# Altium schematic sheet MainMCU.SchDoc
size B; SheetNumber: 3; SheetTotal: 6
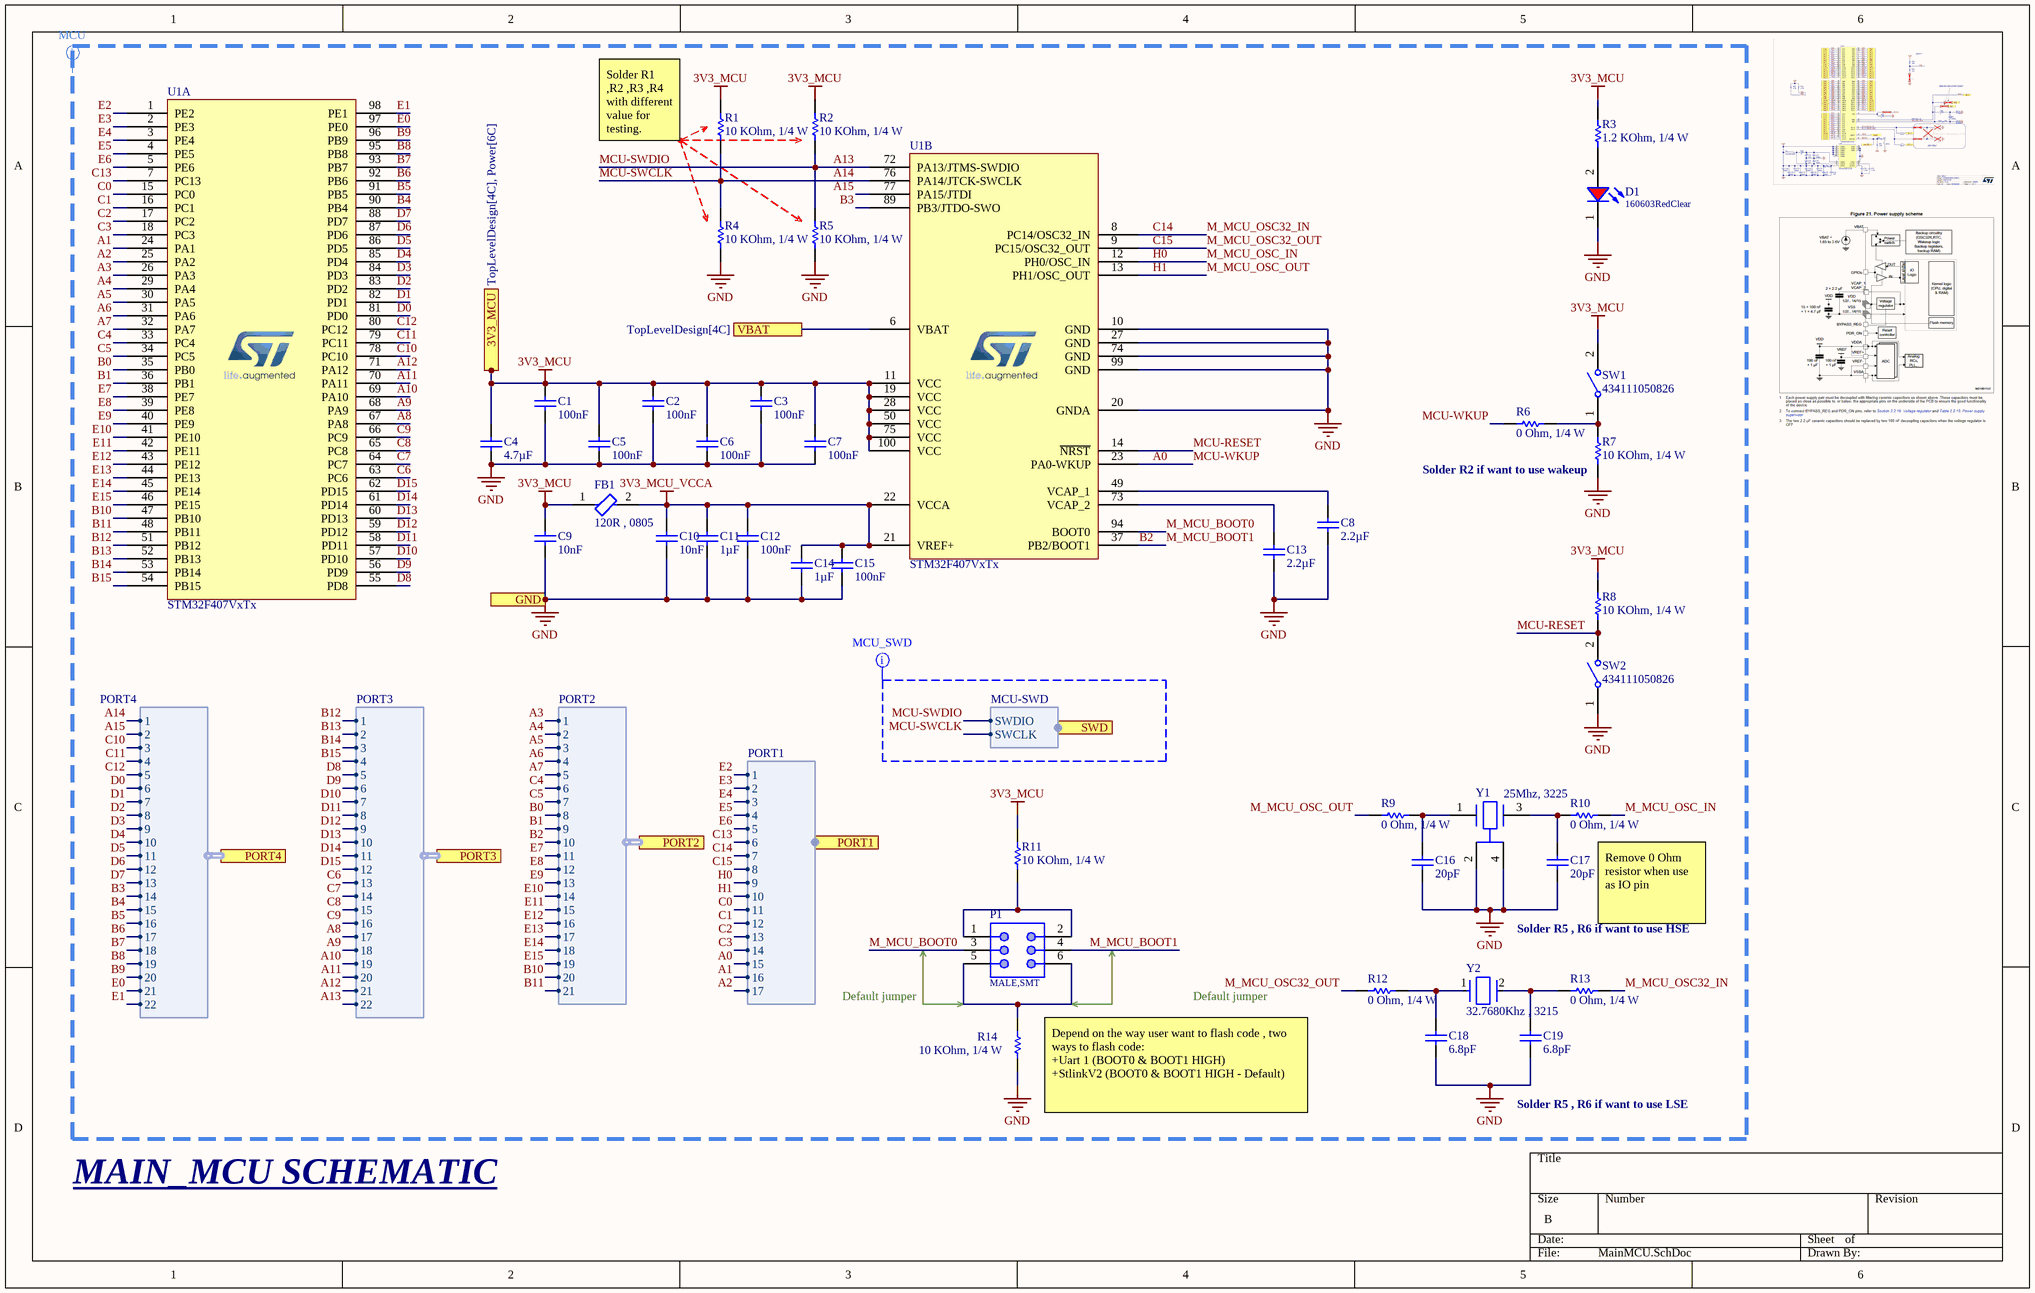
[diagram p0: MainMCU.SchDoc]

## Parts
C1  value 100nF  [CAP_0603]  (hidden comment: 0106031010550)
C2  value 100nF  [CAP_0603]  (hidden comment: 0106031010550)
C3  value 100nF  [CAP_0603]  (hidden comment: 0106031010550)
C4  value 4.7µF  [CAP_0603]  (hidden comment: 0106034751010)
C5  value 100nF  [CAP_0603]  (hidden comment: 0106031010550)
C6  value 100nF  [CAP_0603]  (hidden comment: 0106031010550)
C7  value 100nF  [CAP_0603]  (hidden comment: 0106031010550)
C8  value 2.2µF  [CAP_0603]  (hidden comment: 0106032251010)
C9  value 10nF  [CAP_0603]  (hidden comment: 0106031030550)
C10  value 10nF  [CAP_0603]  (hidden comment: 0106031030550)
C11  value 1µF  [CAP_0603]  (hidden comment: 0106031051035)
C12  value 100nF  [CAP_0603]  (hidden comment: 0106031010550)
C13  value 2.2µF  [CAP_0603]  (hidden comment: 0106032251010)
C14  value 1µF  [CAP_0603]  (hidden comment: 0106031051035)
C15  value 100nF  [CAP_0603]  (hidden comment: 0106031010550)
C16  value 20pF  [CAP_0603]  (hidden comment: 0106031000550)
C17  value 20pF  [CAP_0603]  (hidden comment: 0106031000550)
C18  value 6.8pF  [CAP_0603]  (hidden comment: 0106031000550)
C19  value 6.8pF  [CAP_0603]  (hidden comment: 0106031000550)
D1  160603RedClear  [WL-SMCW_0603_H=0.7mm]
FB1  120R , 0805  [FP-BLM18-0_15-t0_8-MFG]
P1  MALE,SMT  [61030621121]
R1  value 10 KOhm, 1/4 W  [resistor_0603]  (hidden comment: 0006031031)
R2  value 10 KOhm, 1/4 W  [resistor_0603]  (hidden comment: 0006031031)
R3  value 1.2 KOhm, 1/4 W  [resistor_0603]  (hidden comment: 0006031221)
R4  value 10 KOhm, 1/4 W  [resistor_0603]  (hidden comment: 0006031031)
R5  value 10 KOhm, 1/4 W  [resistor_0603]  (hidden comment: 0006031031)
R6  value 0 Ohm, 1/4 W  [resistor_0603]  (hidden comment: 0006030001)
R7  value 10 KOhm, 1/4 W  [resistor_0603]  (hidden comment: 0006031031)
R8  value 10 KOhm, 1/4 W  [resistor_0603]  (hidden comment: 0006031031)
R9  value 0 Ohm, 1/4 W  [resistor_0603]  (hidden comment: 0006030001)
R10  value 0 Ohm, 1/4 W  [resistor_0603]  (hidden comment: 0006030001)
R11  value 10 KOhm, 1/4 W  [resistor_0603]  (hidden comment: 0006031031)
R12  value 0 Ohm, 1/4 W  [resistor_0603]  (hidden comment: 0006030001)
R13  value 0 Ohm, 1/4 W  [resistor_0603]  (hidden comment: 0006030001)
R14  value 10 KOhm, 1/4 W  [resistor_0603]  (hidden comment: 0006031031)
SW1  434111050826  [WS-TASV_L6W3.5H5_4341x10508x6]
SW2  434111050826  [WS-TASV_L6W3.5H5_4341x10508x6]
U1  STM32F407VxTx  [STM32F407VGTx]  (parts A,B of 2)
Y1  25Mhz, 3225  [FP-NX3225SA-MFG]
Y2  32.7680Khz , 3215  [FP-FC-135-MFG]

## Ports
3V3_MCU (see TopLevelDesign[4C], Power[6C]), GND (see TopLevelDesign[4C], Header_and_OnboardConponents[5D], Power[5C], ST-LinkV2[3B]), PORT1 (harness PORT1, see TopLevelDesign[4C]), PORT2 (harness PORT2, see TopLevelDesign[4C]), PORT3 (harness PORT3, see TopLevelDesign[4C]), PORT4 (harness PORT4, see TopLevelDesign[4C]), SWD (harness MCU-SWD, see TopLevelDesign[4C], ST-LinkV2[3C]), VBAT (see TopLevelDesign[4C])

## Harnesses
PORT2: 1, 2, 3, 4, 5, 6, 7, 8, 9, 10, 11, 12, 13, 14, 15, 16, 17, 18, 19, 20, 21
PORT3: 1, 2, 3, 4, 5, 6, 7, 8, 9, 10, 11, 12, 13, 14, 15, 16, 17, 18, 19, 20, 21, 22
PORT1: 1, 2, 3, 4, 5, 6, 7, 8, 9, 10, 11, 12, 13, 14, 15, 16, 17
PORT4: 1, 2, 3, 4, 5, 6, 7, 8, 9, 10, 11, 12, 13, 14, 15, 16, 17, 18, 19, 20, 21, 22
MCU-SWD: SWDIO, SWCLK

## Nets
3V3_MCU: C1.2 C2.2 C3.2 C4.2 C5.2 C6.2 C7.2 C9.2 FB1.1 R1.2 R2.2 R3.2 R8.2 R11.2 SW1.2 U1.11(VCC) U1.19(VCC) U1.28(VCC) U1.50(VCC) U1.75(VCC) U1.100(VCC) ; port 3V3_MCU
3V3_MCU_VCCA: C10.2 C11.2 C12.2 C14.2 C15.2 FB1.2 U1.21(VREF+) U1.22(VCCA)
GND: C1.1 C2.1 C3.1 C4.1 C5.1 C6.1 C7.1 C8.1 C9.1 C10.1 C11.1 C12.1 C13.1 C14.1 C15.1 C16.1 C17.1 C18.1 C19.1 D1.1(K) R4.1 R5.1 R7.1 R14.1 SW2.1 U1.10(GND) U1.20(GNDA) U1.27(GND) U1.74(GND) U1.99(GND) Y1.2(GND) Y1.4(GND) ; port GND
A0: R6.1 U1.23(PA0-WKUP) ; port PORT1.15  [also labelled MCU-WKUP]
A1: U1.24(PA1) ; port PORT1.16
A2: U1.25(PA2) ; port PORT1.17
A3: U1.26(PA3) ; port PORT2.1
A4: U1.29(PA4) ; port PORT2.2
A5: U1.30(PA5) ; port PORT2.3
A6: U1.31(PA6) ; port PORT2.4
A7: U1.32(PA7) ; port PORT2.5
A8: U1.67(PA8) ; port PORT3.17
A9: U1.68(PA9) ; port PORT3.18
A10: U1.69(PA10) ; port PORT3.19
A11: U1.70(PA11) ; port PORT3.20
A12: U1.71(PA12) ; port PORT3.21
A13: R2.1 R5.2 U1.72(PA13/JTMS-SWDIO) ; port PORT3.22, port SWD.SWDIO  [also labelled MCU-SWDIO]
A14: R1.1 R4.2 U1.76(PA14/JTCK-SWCLK) ; port PORT4.1, port SWD.SWCLK  [also labelled MCU-SWCLK]
A15: U1.77(PA15/JTDI) ; port PORT4.2
B0: U1.35(PB0) ; port PORT2.8
B1: U1.36(PB1) ; port PORT2.9
B2: P1.4 U1.37(PB2/BOOT1) ; port PORT2.10  [also labelled M_MCU_BOOT1]
B3: U1.89(PB3/JTDO-SWO) ; port PORT4.14
B4: U1.90(PB4) ; port PORT4.15
B5: U1.91(PB5) ; port PORT4.16
B6: U1.92(PB6) ; port PORT4.17
B7: U1.93(PB7) ; port PORT4.18
B8: U1.95(PB8) ; port PORT4.19
B9: U1.96(PB9) ; port PORT4.20
B10: U1.47(PB10) ; port PORT2.20
B11: U1.48(PB11) ; port PORT2.21
B12: U1.51(PB12) ; port PORT3.1
B13: U1.52(PB13) ; port PORT3.2
B14: U1.53(PB14) ; port PORT3.3
B15: U1.54(PB15) ; port PORT3.4
C0: U1.15(PC0) ; port PORT1.11
C1: U1.16(PC1) ; port PORT1.12
C2: U1.17(PC2) ; port PORT1.13
C3: U1.18(PC3) ; port PORT1.14
C4: U1.33(PC4) ; port PORT2.6
C5: U1.34(PC5) ; port PORT2.7
C6: U1.63(PC6) ; port PORT3.13
C7: U1.64(PC7) ; port PORT3.14
C8: U1.65(PC8) ; port PORT3.15
C9: U1.66(PC9) ; port PORT3.16
C10: U1.78(PC10) ; port PORT4.3
C11: U1.79(PC11) ; port PORT4.4
C12: U1.80(PC12) ; port PORT4.5
C13: U1.7(PC13) ; port PORT1.6
C14: R13.2 U1.8(PC14/OSC32_IN) ; port PORT1.7  [also labelled M_MCU_OSC32_IN]
C15: R12.1 U1.9(PC15/OSC32_OUT) ; port PORT1.8  [also labelled M_MCU_OSC32_OUT]
D0: U1.81(PD0) ; port PORT4.6
D1: U1.82(PD1) ; port PORT4.7
D2: U1.83(PD2) ; port PORT4.8
D3: U1.84(PD3) ; port PORT4.9
D4: U1.85(PD4) ; port PORT4.10
D5: U1.86(PD5) ; port PORT4.11
D6: U1.87(PD6) ; port PORT4.12
D7: U1.88(PD7) ; port PORT4.13
D8: U1.55(PD8) ; port PORT3.5
D9: U1.56(PD9) ; port PORT3.6
D10: U1.57(PD10) ; port PORT3.7
D11: U1.58(PD11) ; port PORT3.8
D12: U1.59(PD12) ; port PORT3.9
D13: U1.60(PD13) ; port PORT3.10
D14: U1.61(PD14) ; port PORT3.11
D15: U1.62(PD15) ; port PORT3.12
E0: U1.97(PE0) ; port PORT4.21
E1: U1.98(PE1) ; port PORT4.22
E2: U1.1(PE2) ; port PORT1.1
E3: U1.2(PE3) ; port PORT1.2
E4: U1.3(PE4) ; port PORT1.3
E5: U1.4(PE5) ; port PORT1.4
E6: U1.5(PE6) ; port PORT1.5
E7: U1.38(PE7) ; port PORT2.11
E8: U1.39(PE8) ; port PORT2.12
E9: U1.40(PE9) ; port PORT2.13
E10: U1.41(PE10) ; port PORT2.14
E11: U1.42(PE11) ; port PORT2.15
E12: U1.43(PE12) ; port PORT2.16
E13: U1.44(PE13) ; port PORT2.17
E14: U1.45(PE14) ; port PORT2.18
E15: U1.46(PE15) ; port PORT2.19
H0: R10.2 U1.12(PH0/OSC_IN) ; port PORT1.9  [also labelled M_MCU_OSC_IN]
H1: R9.1 U1.13(PH1/OSC_OUT) ; port PORT1.10  [also labelled M_MCU_OSC_OUT]
M_MCU_BOOT0: P1.3 U1.94(BOOT0)
MCU-RESET: R8.1 SW2.2 U1.14(~{NRST})
VBAT: U1.6(VBAT) ; port VBAT
NetC8_2: C8.2 U1.49(VCAP_1)
NetC13_2: C13.2 U1.73(VCAP_2)
NetC16_2: C16.2 R9.2 Y1.1
NetC17_2: C17.2 R10.1 Y1.3
NetC18_2: C18.2 R12.2 Y2.1
NetC19_2: C19.2 R13.1 Y2.2
NetD1_2: D1.2(A) R3.1
NetP1_1: P1.1 P1.2 R11.1
NetP1_5: P1.5 P1.6 R14.2
NetR6_2: R6.2 R7.2 SW1.1

## Layout directives
net class MCU_SWD; rule Matched Net Lengths [Delay Tolerance = 70ps]: MCU-SWCLK, MCU-SWDIO
mark named MCU: 3V3_MCU, 3V3_MCU_VCCA, A0, A1, A2, A3, A4, A5, A6, A7, A8, A9, A10, A11, A12, A13, A14, A15, B0, B1, B2, B3, B4, B5, B6, B7, B8, B9, B10, B11, B12, B13, B14, B15, C0, C1, C2, C3, C4, C5, C6, C7, C8, C9, C10, C11, C12, C13, C14, C15, D0, D1, D2, D3, D4, D5, D6, D7, D8, D9, D10, D11, D12, D13, D14, D15, E0, E1, E2, E3, E4, E5, E6, E7, E8, E9, E10, E11, E12, E13, E14, E15, GND, H0, H1, M_MCU_BOOT0, M_MCU_BOOT1, M_MCU_OSC32_IN, M_MCU_OSC32_OUT, M_MCU_OSC_IN, M_MCU_OSC_OUT, MCU-RESET, MCU-SWCLK, MCU-SWDIO, MCU-WKUP

## Notes on the sheet
- (near R1) Solder R1 ,R2 ,R3 ,R4 with different value for testing.
- (near R7) Solder R2 if want to use wakeup
- Solder R5 , R6 if want to use HSE
- Remove 0 Ohm resistor when use as IO pin
- Default jumper
- (near R14) Depend on the way user want to flash code , two ways to flash code:
  +Uart 1 (BOOT0 & BOOT1 HIGH)
  +StlinkV2 (BOOT0 & BOOT1 HIGH - Default)
- Solder R5 , R6 if want to use LSE
- MAIN_MCU SCHEMATIC

## Library data of the parts
C1-C3 C5-C7 C12 C15 = CMP-001-00209-1: CAP, size 0603, 100 nF, 50 VDC; Manufacture Name: TDK; Manufacture SN: CGA3E2C0G1H101J080AA; Voltage Rating DC: 50 VDC; Tolerance: 5%; Packaging: Tape and Reel; Supplier 3 SN: N/A; Source: Capacitor_0603_5_percent.SchLib; Supplier 1 URL: https://www.mouser.com/ProductDetail/TDK/CGA3E2C0G1H101J080AA?qs=FxQuwy19cyBF0gUakpLdHA%3D%3D&utm_source=mouser-refine-download&utm_medium=file&utm_campaign=CGA3E2C0G1H101J080AA&utm_content=TDK; Supplier 3 URL: N/A; Supplier 2 URL: https://www.digikey.com/en/products/detail/tdk-corporation/cga3e2c0g1h101j080aa/2443118; Supplier 2 Name: Digi-Key; Supplier 1 SN: 810-CGA3E2C0G1H101J; Mounting Technology: SMT; Size: 0603; Design Item ID: 0106031010550; Supplier 1 Name: Mouser; Component Type: Standard; Operating Temperature: -55 to +125degC; Supplier 3 Name: thegioiic; Pins: 2; Supplier 2 SN: 445-5640-2-ND
C4 = CMP-001-00249-1: CAP, size 0603, 4.7 uF, 10 VDC; Manufacture SN: CL10A475KP8NNWC; Manufacture Name: Samsung Electro-Mechanics; Tolerance: 10%; Voltage Rating DC: 10 VDC; Mounting Technology: SMT; Supplier 3 URL: https://www.thegioiic.com/tu-gom-0603-4-7uf-25v; Source: Capacitor_0603_10_percent.SchLib; Packaging: Tape and Reel; Component Type: Standard; Supplier 2 SN: 1276-CL10A475KP8NNWCTR-ND; Pins: 2; Size: 0603; Supplier 1 URL: https://www.mouser.vn/ProductDetail/Samsung-Electro-Mechanics/CL10A475KP8NNWC?qs=81r%252BiQLm7BQyXBb52PEUBA%3D%3D&utm_source=mouser-refine-download&utm_medium=file&utm_campaign=CL10A475KP8NNWC&utm_content=Samsung-Electro-Mechanics; Supplier 2 URL: https://www.digikey.com/en/products/detail/samsung-electro-mechanics/cl10a475kp8nnwc/16572736; Design Item ID: 0106034751010; Supplier 3 Name: thegioiic; Supplier 2 Name: Digi-Key; Supplier 1 SN: 187-CL10A475KP8NNWC; Supplier 1 Name: Mouser; Supplier 3 SN: N/A; Operating Temperature: -55 to +125degC
C8 C13 = CMP-001-00232-1: CAP, size 0603, 2.2 uF, 10 VDC; Manufacture SN: CL10A225KP8NNWC; Manufacture Name: Samsung Electro-Mechanics; Voltage Rating DC: 10 VDC; Tolerance: 10%; Supplier 2 SN: 1276-CL10A225KP8NNWCTR-ND; Supplier 1 Name: Mouser; Supplier 2 Name: Digi-Key; Size: 0603; Supplier 3 URL: N/A; Supplier 2 URL: https://www.digikey.com/en/products/detail/samsung-electro-mechanics/cl10a225kp8nnwc/16572766; Supplier 3 Name: thegioiic; Design Item ID: 0106032251010; Supplier 3 SN: N/A; Operating Temperature: -55 to +125degC; Source: Capacitor_0603_10_percent.SchLib; Supplier 1 URL: https://www.mouser.vn/ProductDetail/Samsung-Electro-Mechanics/CL10A225KP8NNWC?qs=f6khj2Jg0Fj5oIVDjMV6rg%3D%3D&utm_source=mouser-refine-download&utm_medium=file&utm_campaign=CL10A225KP8NNWC&utm_content=Samsung-Electro-Mechanics; Supplier 1 SN: 187-CL10A225KP8NNWC; Component Type: Standard; Packaging: Tape and Reel; Mounting Technology: SMT; Pins: 2
C9 C10 = CMP-001-00212-1: CAP, size 0603, 10 nF, 50 VDC; Manufacture SN: CGA3E2C0G1H103J080AE; Manufacture Name: TDK; Tolerance: 5%; Voltage Rating DC: 50 VDC; Design Item ID: 0106031030550; Pins: 2; Operating Temperature: -55 to +125degC; Packaging: Tape and Reel; Supplier 1 SN: 810-CGA3E2C0G1H103J8; Source: Capacitor_0603_5_percent.SchLib; Supplier 3 URL: N/A; Component Type: Standard; Supplier 3 SN: N/A; Supplier 2 Name: Digi-Key; Mounting Technology: SMT; Supplier 3 Name: thegioiic; Supplier 1 URL: https://www.mouser.com/ProductDetail/TDK/CGA3E2C0G1H103J080AE?qs=P1JMDcb91o6ZkMITrWTUZQ%3D%3D&utm_source=mouser-refine-download&utm_medium=file&utm_campaign=CGA3E2C0G1H103J080AE&utm_content=TDK; Supplier 2 URL: https://www.digikey.com/en/products/detail/tdk-corporation/cga3e2c0g1h103j080ae/11697946; Supplier 2 SN: 445-CGA3E2C0G1H103J080AETR-ND; Supplier 1 Name: Mouser; Size: 0603
C11 C14 = CMP-001-00217-1: CAP, size 0603, 1 uF, 35 VDC; Manufacture Name: Samsung Electro-Mechanics; Manufacture SN: CL10B105KL9VPJC; Tolerance: 10%; Voltage Rating DC: 35 VDC; Supplier 1 SN: 187-CL10B105KL9VPJC; Supplier 1 URL: https://www.mouser.vn/ProductDetail/Samsung-Electro-Mechanics/CL10B105KL9VPJC?qs=Jm2GQyTW%2Fbg7HPXOYntRzg%3D%3D&utm_source=mouser-refine-download&utm_medium=file&utm_campaign=CL10B105KL9VPJC&utm_content=Samsung-Electro-Mechanics; Pins: 2; Supplier 2 URL: N/A; Mounting Technology: SMT; Operating Temperature: -55 to +125degC; Supplier 1 Name: Mouser; Component Type: Standard; Design Item ID: 0106031051035; Size: 0603; Supplier 3 SN: N/A; Source: Capacitor_0603_10_percent.SchLib; Supplier 3 Name: thegioiic; Supplier 2 SN: N/A; Supplier 3 URL: N/A; Packaging: Tape and Reel; Supplier 2 Name: Digi-Key
C16 C17 = CMP-001-00208-1: CAP, size 0603, 20 pF, 50 VDC; Manufacture SN: CGA3E2NP01H100D080AA; Manufacture Name: TDK; Tolerance: 5%; Voltage Rating DC: 50 VDC; Component Type: Standard; Size: 0603; Source: Capacitor_0603_5_percent.SchLib; Supplier 3 SN: N/A; Supplier 2 URL: https://www.digikey.com/en/products/detail/tdk-corporation/cga3e2np01h100d080aa/3949623; Supplier 1 Name: Mouser; Pins: 2; Supplier 1 SN: 810-CGA3E2NP01H100DA; Packaging: Tape and Reel; Supplier 2 Name: Digi-Key; Supplier 3 Name: thegioiic; Supplier 2 SN: 445-12387-2-ND; Operating Temperature: -55 to +125degC; Supplier 1 URL: https://www.mouser.com/ProductDetail/TDK/CGA3E2NP01H100D080AA?qs=xLDY6iXSiQYSDBjUp7bVxg%3D%3D&utm_source=mouser-refine-download&utm_medium=file&utm_campaign=CGA3E2NP01H100D080AA&utm_content=TDK; Design Item ID: 0106031000550; Supplier 3 URL: N/A; Mounting Technology: SMT
C18 C19 = CMP-001-00208-1: CAP, size 0603, 6.8 pF, 50 VDC; Manufacture SN: CGA3E2NP01H100D080AA; Manufacture Name: TDK; Tolerance: 5%; Voltage Rating DC: 50 VDC; Component Type: Standard; Size: 0603; Source: Capacitor_0603_5_percent.SchLib; Supplier 3 SN: N/A; Supplier 2 URL: https://www.digikey.com/en/products/detail/tdk-corporation/cga3e2np01h100d080aa/3949623; Supplier 1 Name: Mouser; Pins: 2; Supplier 1 SN: 810-CGA3E2NP01H100DA; Packaging: Tape and Reel; Supplier 2 Name: Digi-Key; Supplier 3 Name: thegioiic; Supplier 2 SN: 445-12387-2-ND; Operating Temperature: -55 to +125degC; Supplier 1 URL: https://www.mouser.com/ProductDetail/TDK/CGA3E2NP01H100D080AA?qs=xLDY6iXSiQYSDBjUp7bVxg%3D%3D&utm_source=mouser-refine-download&utm_medium=file&utm_campaign=CGA3E2NP01H100D080AA&utm_content=TDK; Design Item ID: 0106031000550; Supplier 3 URL: N/A; Mounting Technology: SMT
D1 = CMP-004-00094-1: WL-SMCW SMT Mono-color Chip LED Waterclear, size 0603, Red, 2V, 140deg; Type: Clear; Value: Red, 2V; ComponentLink4URL: https://www.thegioiic.com/led-do-0603-dan-smd-trong-suot; Supplier 3 URL: https://www.thegioiic.com/led-do-0603-dan-smd-trong-suot; ComponentLink3URL: https://www.digikey.com/en/products/detail/liteon/LTST-C191KRKT/386837; Component Type: Standard; ComponentLink4Description: Supplier 3 URL; Supplier 3 SN: N/A; Pins: 2; Size: 0603; Supplier 2 URL: https://www.digikey.com/en/products/detail/liteon/LTST-C191KRKT/386837; ComponentLink2Description: Supplier 1 URL; Color: Red; Supplier 1 URL: https://www.mouser.vn/ProductDetail/Wurth-Elektronik/150060RS75000?qs=LlUlMxKIyB3QnmZ3fw%2FVCA%3D%3D; Supplier 2 Name: Digi-Key; ComponentLink2URL: https://www.mouser.vn/ProductDetail/Wurth-Elektronik/150060RS75000?qs=LlUlMxKIyB3QnmZ3fw%2FVCA%3D%3D; Supplier 2 SN: 160-1447-2-ND; ComponentLink3Description: Supplier 2 URL; Supplier 1 SN: 710-150060RS75000; Source: WL-SMCW_0603.SchLib; Supplier 3 Name: ICDayRoi; ComponentLink1URL: N/A; Supplier 1 Name: Mouser; ComponentLink1Description: Datasheet link; Design Item ID: 160603RedClear
FB1 = CMP-006-00234-1: Ferrite Chip, 1 Function(s), 2A, 2 Pin(s); DC Resistance-Max: 50mR; Width: 0.8mm; Current Rating: 2A; Height: 0.8mm; Length: 1.6mm; Min Operating Temperature: -55°C; Material: Ferrite; RoHS Compliant: Yes; Max Operating Temperature: 125°C; Packaging: Tape and Reel
P1 = CMP-002-00439-1: WR-PHD Pin Header, SMT, pitch 2.54mm, Dual Row, Vertical, 6p; Manufacturer: Wurth Elektronik; Working Voltage: 250VAC; Rated Current: 3A; Withstanding Voltage: 500VAC; Supply name 1: Mouser; Contact Resistance: 20mOhm; Pin Number: 6; Source: WR-PHD_Pin Header_2.54mm.SchLib; Supplier 2 SN: N/A; Supplier 1 SN: 710-61000621121; Pitch: 2.54mm; Design Item ID: 61030621121; ComponentLink4URL: https://www.mouser.vn/ProductDetail/Wurth-Elektronik/61030621121?qs=PhR8RmCirEbl%2F20%2FFLRJRA%3D%3D; ComponentLink4Description: Global Supply; Row Number: Dual; Supplier 2 URL: N/A; Pins: 6; Supplier 3 SN: N/A; Manufacturer Part Number: 61030621121; Supplier 2 Name: Digi-Key; ComponentLink2Description: Datasheet; ComponentLink1URL: http://www.we-online.de; Packaging: Tape and Reel; Supplier 3 Name: thegioiic; Published Date: May 2020; Supplier 1 URL: https://www.mouser.vn/ProductDetail/Wurth-Elektronik/61000621121?qs=PhR8RmCirEYoFU9UUO%252Bbug%3D%3D; ComponentLink3URL: https://www.we-online.com/en/components/products/PHD_2_54_SMT_DUAL_PIN_HEADER_6100XX21121?sq=61030621121#61030621121; Mounting Technology: SMT; ComponentLink2URL: https://www.we-online.com/catalog/datasheet/61030621121.pdf; Orientation: Vertical; ComponentLink3Description: Global Supply; Component Type: Standard; ComponentLink1Description: Manufacturer; Supplier 1 Name: Mouser; Gender: Pin Header; Supplier 3 URL: N/A; Operating Temperature: -40 to +125degC
R1 R2 R4 R5 R7 R8 R11 R14 = CMP-009-00188-1: RES, size 0603, 10 KOhm, 1/4 W; Manufacture  Name: OEM; Rated Power: 1/4 W; Resistance Tolerance: +/-1%; ComponentLink1Description: Datasheet link; Size: 0603; Supplier 2 SN: RHM10KADTR-ND RHM10KADCT-ND RHM10KADDKR-ND; Mounting Technology: SMT; ComponentLink2URL: N/A; Design Item ID: 0006031031; Supplier 1 Name: Mouser; Component Type: Standard; Supplier 2 URL: https://www.digikey.com/en/products/detail/rohm-semiconductor/ESR03EZPF1002/1983429; Manufacture  SN: OEM; Supplier 2 Name: Digi-Key; Supplier 3 URL: N/A; Source: Resistor_0603.SchLib; ComponentLink1URL: https://fscdn.rohm.com/en/products/databook/datasheet/passive/resistor/chip_resistor/esr-e.pdf; Pins: 2; ComponentLink3Description: Supplier 2 URL; Supplier 1 URL: https://www.mouser.vn/ProductDetail/ROHM-Semiconductor/ESR03EZPF1002?qs=sGAEpiMZZMvdGkrng054t67Efho1F8r6CDeAsqwFse8%3D; Supplier 1 SN: 755-ESR03EZPF1002; Supplier 3 SN: N/A; ComponentLink3URL: https://www.digikey.com/en/products/detail/rohm-semiconductor/ESR03EZPF1002/1983429; ComponentLink4Description: Supplier 3 URL; Supplier 3 Name: thegioiic; ComponentLink2Description: Supplier 1 URL; ComponentLink4URL: N/A
R3 = CMP-009-00209-1: RES, size 0603, 1.2 KOhm, 1/4 W; Manufacture  Name: OEM; Rated Power: 1/4 W; Resistance Tolerance: +/-1%; ComponentLink2URL: N/A; ComponentLink4URL: N/A; ComponentLink2Description: Supplier 1 URL; Design Item ID: 0006031221; ComponentLink1Description: Datasheet link; Pins: 2; Supplier 1 SN: 667-ERJ-UP3F1201V; Supplier 1 URL: https://www.mouser.vn/ProductDetail/Panasonic/ERJ-UP3F1201V?qs=sGAEpiMZZMvdGkrng054twq3eZrCFN895BO3G72d%2F02jECAea43bgQ%3D%3D; Supplier 3 URL: N/A; Source: Resistor_0603.SchLib; ComponentLink1URL: https://api.pim.na.industrial.panasonic.com/file_stream/main/fileversion/4484; Supplier 3 Name: thegioiic; Supplier 2 Name: Digi-Key; ComponentLink3Description: Supplier 2 URL; Component Type: Standard; Mounting Technology: SMT; ComponentLink4Description: Supplier 3 URL; Supplier 1 Name: Mouser; ComponentLink3URL: N/A; Manufacture  SN: OEM; Supplier 2 URL: N/A; Size: 0603; Supplier 3 SN: N/A; Supplier 2 SN: 10-ERJ-UP3F1201VTR-ND 10-ERJ-UP3F1201VCT-ND 10-ERJ-UP3F1201VDKR-ND
R6 R9 R10 R12 R13 = CMP-009-00180-1: RES, size 0603, 0 Ohm, 1/4 W; Manufacture  Name: YAGEO; Manufacture  SN: AC0603FR-070RL; Resistance Tolerance: +/-1%; Rated Power: 1/4 W; Pins: 2; ComponentLink1Description: Datasheet link; ComponentLink4URL: N/A; Component Type: Standard; ComponentLink2URL: N/A; Supplier 2 URL: https://www.digikey.com/en/products/detail/yageo/ac0603fr-070rl/2827812; Supplier 1 Name: Mouser; Supplier 1 SN: 603-AC0603FR-070RL; ComponentLink1URL: https://www.mouser.com/datasheet/2/447/Yageo_06282023_ACseries-3224032.pdf; Mounting Technology: SMT; ComponentLink2Description: Supplier 1 URL; Size: 0603; Supplier 2 SN: 311-0.0LDTR-ND; ComponentLink4Description: Supplier 3 URL; ComponentLink3URL: https://www.digikey.com/en/products/detail/yageo/ac0603fr-070rl/2827812; ComponentLink3Description: Supplier 2 URL; Supplier 3 Name: thegioiic; Supplier 3 SN: N/A; Supplier 2 Name: Digi-Key; Source: Resistor_0603.SchLib; Design Item ID: 0006030001; Supplier 3 URL: https://www.thegioiic.com/dien-tro-0-ohm-0603-1-; Supplier 1 URL: https://www.mouser.com/ProductDetail/YAGEO/AC0603FR-070RL?qs=sGAEpiMZZMtlubZbdhIBIOG3KwTtqrl%2FD2D%252BGuMCfoY%3D
SW1 SW2 = CMP-011-00108-1: WS-TASV SMT Tact Switch, L6 x W3.5 x H5mm, 260g, SPST-NO, 12V, 50mA; Manufacturer: Wurth Elektronik; Washable: No; Rated Voltage: 12VDC; Supplier 2 Name: Digi-Key; Design Item ID: 434111050826; Height: 5mm; Supplier 1 SN: 710-434111050826; Manufacturer Part Number: 434111050826; Width: 3.5mm; Terminal Material: Copper Alloy; Supplier 1 URL: https://www.mouser.vn/ProductDetail/Wurth-Elektronik/434111050826?qs=wr8lucFkNMW%252BYjUPWhhK5A%3D%3D; Source: Button.SchLib; Contact Material: Stainless Steel; Supplier 3 SN: N/A; Component Type: Standard; Supplier 2 URL: https://www.digikey.com/en/products/detail/w%C3%BCrth-elektronik/434111050826/5209074; Circuit: SPST-NO; Supplier 2 SN: 732-7041-2-ND; Match Code: WS-TASV; Terminal Plating: Silver; Supplier 3 Name: Thegioiic; Pins: 2; Category: Tact Switches; Supplier 3 URL: https://www.thegioiic.com/nut-nhan-3-5x6mm-cao-5mm-2-chan-smd-dau-trang; Packaging: Tape and Reel; Operating Temperature Max: 85°C; Mount: Surface Mount; Rated Current: 50mA; Operation Force: 260g; Operating Temperature Min: -40°C; Length: 6mm; Supplier 1 Name: Mouser
U1 = STM32F407VGTx-000006-1: ARM Microcontrollers - MCU ARM M4 1024 FLASH 168 Mhz 192kB SRAM; Part Number: STM32F407IGTx; Manufacturer: STM; Pad count: 100; ComponentLink4URL: N.A; ComponentLink2Description: Supplier 1 URL; Source: STM32.SchLib; Supplier 3 SN: N.A; Supplier 2 Name: Digi-Key; Supplier 1 URL: https://www.mouser.com/ProductDetail/STMicroelectronics/STM32F407VGT6?qs=Z8%252BeY1k3TIKAEQqwbO%2FOzA%3D%3D; ComponentLink1URL: https://www.mouser.com/datasheet/2/389/stm32f745ie-1851206.pdf; ComponentLink2URL: https://www.mouser.com/ProductDetail/STMicroelectronics/STM32F407VGT6?qs=Z8%252BeY1k3TIKAEQqwbO%2FOzA%3D%3D; ComponentLink3Description: Supplier 2 URL; Supplier 1 Name: Mouser; Supplier 2 SN: 497-11605-ND; Supplier 3 URL: N.A; ComponentLink4Description: Supplier 3 URL; ComponentLink3URL: 497-11605-ND; Footprint name: LQFP100; Supplier 2 URL: https://www.digikey.com/en/products/detail/stmicroelectronics/stm32f407vgt6/2747117; Supplier 1 SN: 511-STM32F407VGT6; Design Item ID: STM32F407VGTx; Value: STM32F407VGTx; Pins: 100; Component Type: Standard; Manufacture SN: STM32F407VGTx; ComponentLink1Description: Datasheet; Supplier 3 Name: thegioiic
Y1 = CMP-003-00057-1: CRYSTAL 25.0000MHZ 8PF SMD; Manufacturer: NDK; Manufacturer Part Number: NX3225SA-25.000M-STD-CRS-2; Esr: 100; Tolerance: 15ppm; Automotive Grade: Grade 1; Load Capacitance: 8pF; Octopart: https://octopart.com/nx3225sa-25.000m-std-crs-2-ndk-51374293; Temperature: -40°C to +125°C; Category: Crys; Source: Components - 28.03.25 - 23.15.SchLib; Component Type: Standard; Lead Free: Yes; Pins: 4; Frequency: 25MHz; Case/Package: NX3225SA; Temperature Range Low: -40°C; Device Class L3: Crystals; Series: NX3225SA; RoHS: TRUE; Design Item ID: CMP-200220-000002-1; Height: 0.6mm; Automotive: Yes; Device Class L1: Passive Components; Temperature Range High: 125°C; Digikey Description: CRYSTAL 25.0000MHZ 8PF SMD; Device Class L2: Crystals / Oscillators
Y2 = CMP-003-00053-1: Parallel - Fundamental Quartz Crystal, 0.032768MHz Nom; Frequency Stability: 0.0144%; Load Capacitance: 12.5pF; Frequency Tolerance: 20ppm; Min Operating Temperature: -40°C; Max Operating Temperature: 85°C